# EAGLE schematic bitsClassicEdit (EAGLE 7.6.0)
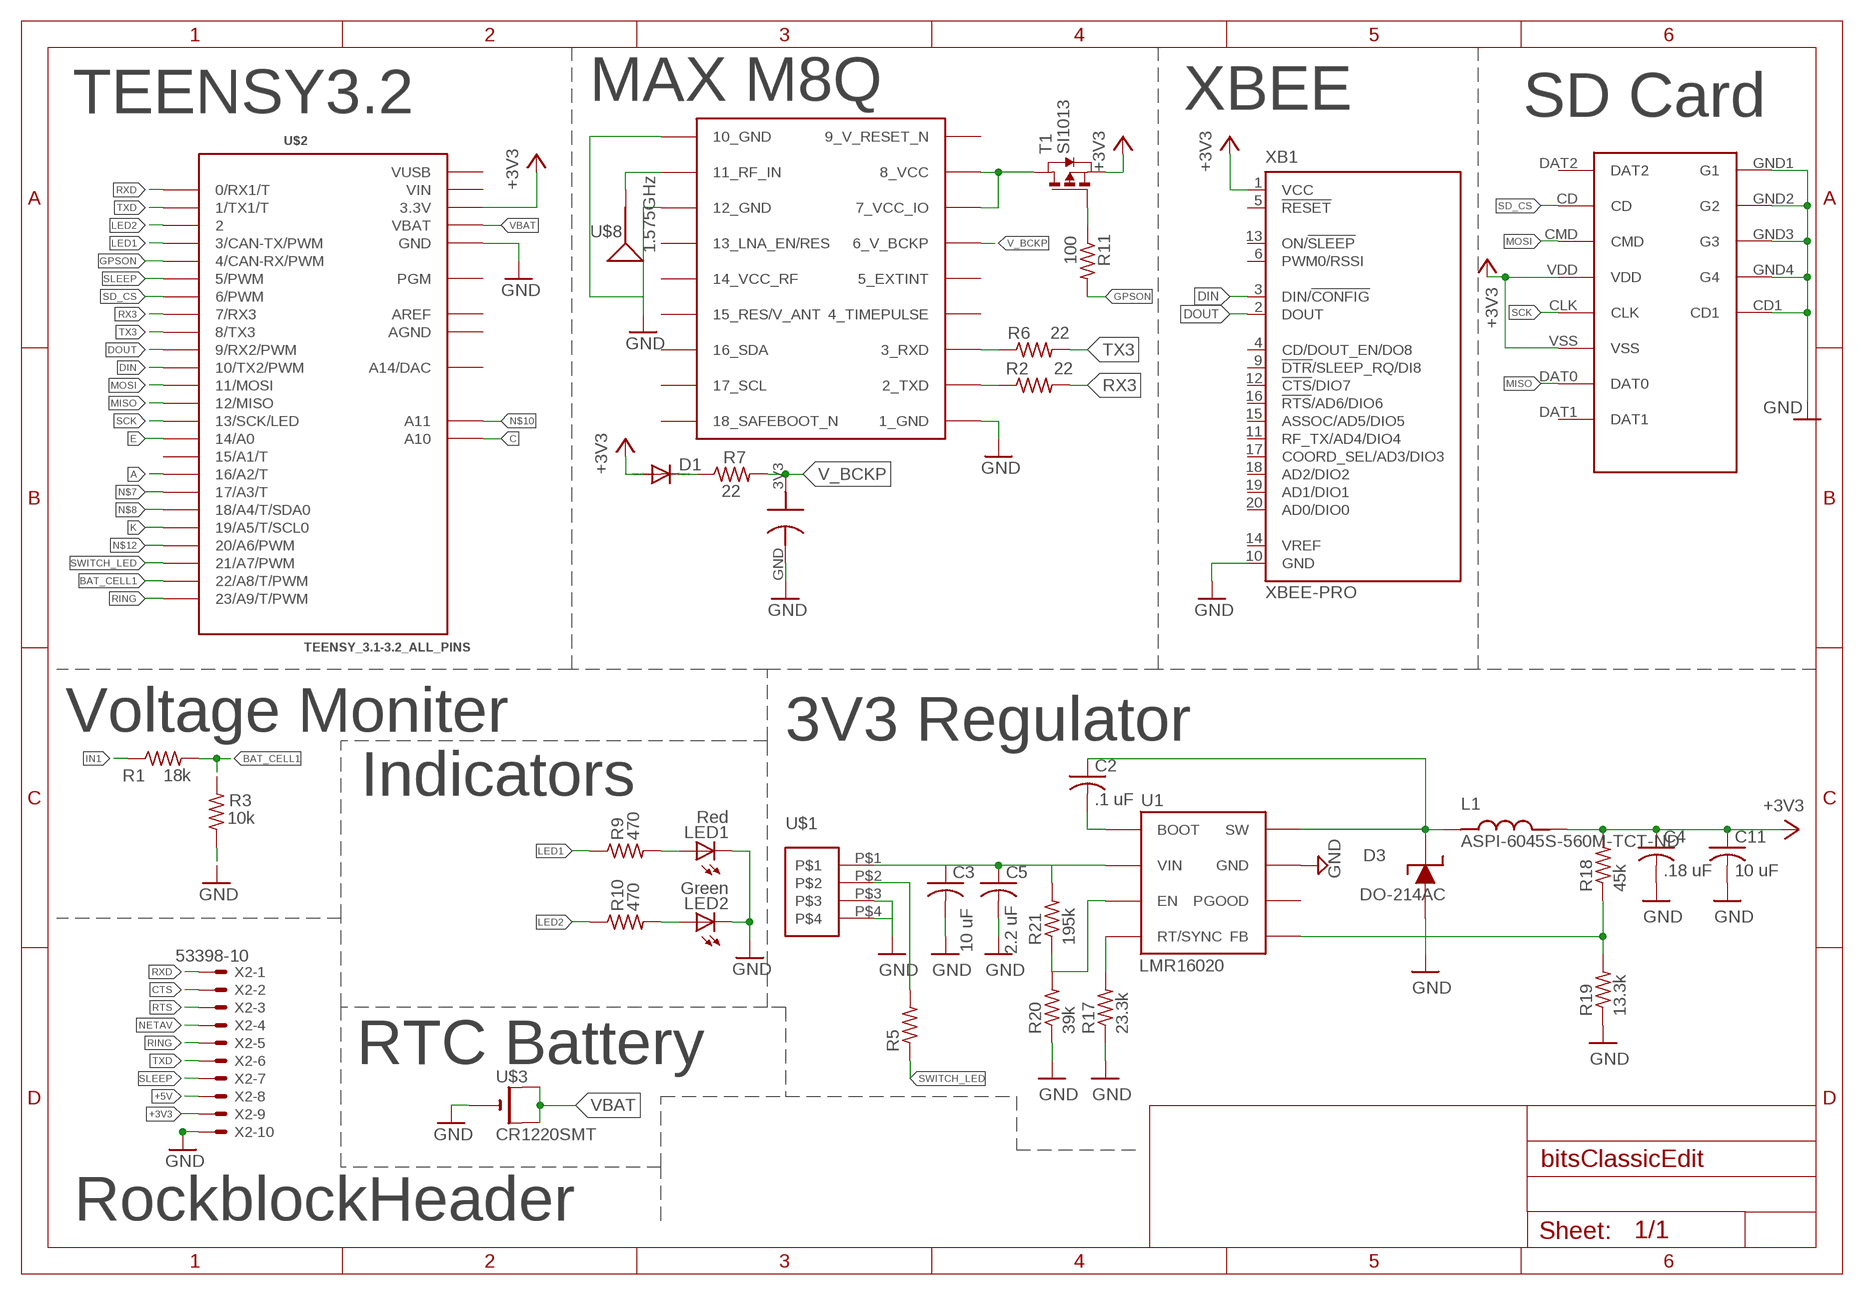
[diagram p0: schematic, sheet 1]

## Parts
C1  DCK-3R3E204T614-E  [ELNASUPERCAP]
C2  .1 uF  C-USC0603  [C0603]
C3  10 uF  C-USC1210  [C1210]
C4  .18 uF  C-USC0603  [C0603]
C5  2.2 uF  C-USC1210  [C1210]
C11  10 uF  C-USC0603  [C0603]
D1  DIODE-SOD523  [SOD523]
D3  DO-214AC  [DO-214AC]
L1  ASPI-6045S-560M-TCT-ND  [ABRACON]
LED1  Red  LEDCHIP-LED0603  [CHIP-LED0603]
LED2  Green  LEDCHIP-LED0603  [CHIP-LED0603]
R1  18k  R-US_R0603  [R0603]
R2  22  R-US_R0603  [R0603]
R3  10k  R-US_R0603  [R0603]
R5  R-US_R0603  [R0603]
R6  22  R-US_R0603  [R0603]
R7  22  R-US_R0603  [R0603]
R9  470  R-US_R0603  [R0603]
R10  470  R-US_R0603  [R0603]
R11  100  R-US_R0603  [R0603]
R17  23.3k  R-US_R0603  [R0603]
R18  45k  R-US_R0603  [R0603]
R19  13.3k  R-US_R0603  [R0603]
R20  39k  R-US_R0603  [R0603]
R21  195k  R-US_R0603  [R0603]
T1  SI1013  [SC-75]
U1  LMR16020  [SO8]
U$1  MICROCLASP_4  [4_PIN_MICROCLASP]
U$2  TEENSY_3.1-3.2_ALL_PINS  [TEENSY_3.0-3.2&LC_ALL_PINS]
U$3  CR1220SMT  [CR1220-SMD]
U$4  MICRO_SD  [MICRO_SD_HINGED]
U$7  MAX-M8  [MAX-M8]
U$8  1.575GHz  SPARKFUN-GPS_ANTENNAGPS-2X7MM  [SPARKFUN-GPS_ANT-GPS-2X7MM]
X2  53398-10  [53398-10]
XB1  XBEE-PRO  [XBEE-PRO]

## Nets
+3V3: C4.1 C11.1 D1.A L1.P$2 R18.2 T1.P$2(S) U$2.3.3V U$2.3.3V1(3.3V) U$4.VDD U$4.VSS X2.9 XB1.1(VCC)
+5V: X2.8
A: U$2.16/A2(16/A2/T)
BAT_CELL1: R1.2 R3.2 U$2.22/A8(22/A8/T/PWM)
C: U$2.A10
CTS: X2.2
DIN: U$2.10(10/TX2/PWM) XB1.3(DIN/!CONFIG)
DOUT: U$2.9(9/RX2/PWM) XB1.2(DOUT)
E: U$2.14/A0
FB: R18.1 R19.2 U1.P$5(FB)
GND: C1.GND C3.2 C4.2 C5.2 C11.2 D3.P$1 LED1.C LED2.C R3.1 R17.1 R19.1 R20.1 U1.P$7(GND) U1.PAD(GND) U$1.P$3 U$1.P$4 U$2.GND U$2.GND1(GND) U$3.- U$4.CD1 U$4.GND1(G1) U$4.GND2(G2) U$4.GND3(G3) U$4.GND4(G4) U$7.1_GND U$7.10_GND U$7.12_GND X2.10 XB1.10(GND)
GPSON: R11.2 U$2.4(4/CAN-RX/PWM)
IN1: C3.1 C5.1 R1.1 R21.2 U1.P$2(VIN) U$1.P$1
K: U$2.19/A5(19/A5/T/SCL0)
LED1: R9.1 U$2.3(3/CAN-TX/PWM)
LED2: R10.1 U$2.2
MISO: U$2.12(12/MISO) U$4.DAT0
MOSI: U$2.11(11/MOSI) U$4.CMD
N$1: U$7.11_RF_IN U$8.1(SIGNAL)
N$2: D1.C R7.1
N$3: R6.1 U$7.3_RXD
N$4: R2.1 U$7.2_TXD
N$5: LED2.A R10.2
N$6: LED1.A R9.2
N$7: U$2.17/A3(17/A3/T)
N$8: U$2.18/A4(18/A4/T/SDA0)
N$9: R11.1 T1.P$1(G)
N$10: U$2.A11
N$11: T1.P$3(D) U$7.7_VCC_IO U$7.8_VCC
N$12: U$2.20/A6(20/A6/PWM)
N$29: R17.2 U1.P$4(RT/SYNC)
N$31: C2.2 U1.P$1(BOOT)
N$33: R5.2 U$1.P$2
N$34: R20.2 R21.1 U1.P$3(EN)
NETAV: X2.4
RING: U$2.23/A9(23/A9/T/PWM) X2.5
RTS: X2.3
RX3: R2.2 U$2.7(7/RX3)
RXD: U$2.0(0/RX1/T) X2.1
SCK: U$2.13(13/SCK/LED) U$4.CLK
SD_CS: U$2.6(6/PWM) U$4.CD
SLEEP: U$2.5(5/PWM) X2.7
SW: C2.1 D3.P$2 L1.P$1 U1.P$8(SW)
SWITCH_LED: R5.1 U$2.21/A7(21/A7/PWM)
TX3: R6.2 U$2.8(8/TX3)
TXD: U$2.1(1/TX1/T) X2.6
V_BCKP: C1.3V3 R7.2 U$7.6_V_BCKP
VBAT: U$2.VBAT U$3.+$1(+) U$3.+$2(+1)
Unconnected: U1.P$6(PGOOD) U$2.15/A1(15/A1/T) U$2.PGM U$2.RESET/DAC(A14/DAC) U$4.DAT1 U$4.DAT2 U$7.4_TIMEPULSE U$7.5_EXTINT U$7.13_LNA_EN(13_LNA_EN/RES) U$7.14_VCC_RF U$7.15_V_ANT/RESERVED(15_RES/V_ANT) U$7.16_SDA U$7.17_SCL U$7.18_SAFEBOOT_N XB1.4(CD/DOUT_EN/DO8) XB1.5(!RESET) XB1.6(PWM0/RSSI) XB1.9(!DTR!/SLEEP_RQ/DI8) XB1.11(RF_TX/AD4/DIO4) XB1.12(!CTS!/DIO7) XB1.13(ON/!SLEEP) XB1.14(VREF) XB1.15(ASSOC/AD5/DIO5) XB1.16(!RTS!/AD6/DIO6) XB1.17(COORD_SEL/AD3/DIO3) XB1.18(AD2/DIO2) XB1.19(AD1/DIO1) XB1.20(AD0/DIO0)

## Notes on the sheet
- TEENSY3.2 | MAX M8Q | XBEE | SD Card
- Voltage Moniter | 3V3 Regulator
- Indicators
- RTC Battery
- RockblockHeader

## Power pins joined to a net without a drawn wire
9_V_RESET_N: U$7.9_RESET_N(9_V_RESET_N)
AGND: U$2.AGND
AREF: U$2.AREF
VIN: U$2.VIN
VUSB: U$2.VUSB

## Library data of the parts
C1 = jmolterLib:DCK-3R3E204T614-E: ELNA Supercapacitor 3.3V max DCK-3R3E204T614-E 0.2F DCK-3R3E404T614-E 0.4F
C2-C5 C11 = resistor:C-US: CAPACITOR, American symbol
D1 = diode:DIODE-: DIODE
D3 = HASP:DO-214AC
L1 = inductors:ASPI-6045S-560M-TCT-ND
LED1 LED2 = led:LED: LED OSRAM: - CHIPLED LG R971, LG N971, LY N971, LG Q971, LY Q971, LO R971, LY R971 LH N974, LH R974 LS Q976, LO Q976, LY Q976 LO Q996 - Hyper CHIPLED LW Q18S LB Q993, LB Q99A, LB R99A - SideLED LS A670, LO A670, LY A670, LG A670, LP A670 LB A673, LV A673, LT A673, LW A673 LH A674 LY A675 LS A676, LA A676, LO A676, LY A676, LW A676 LS A679, LY A679, LG A679 - Hyper Micro SIDELED® LS Y876, LA Y876, LO Y876, LY Y876 LT Y87S - SmartLED LW L88C, LW L88S LB L89C, LB L89S, LG L890 LS L89K, LO L89K, LY L89K LS L896, LA L896, LO L896, LY L896 - TOPLED LS T670, LO T670, LY T670, LG T670, LP T670 LSG T670, LSP T670, LSY T670, LOP T670, LYG T670 LG T671, LOG T671, LSG T671 LB T673, LV T673, LT T673, LW T673 LH T674 LS T676, LA T676, LO T676, LY T676, LB T676, LH T676, LSB T676, LW T676 LB T67C, LV T67C, LT T67C, LS T67K, LO T67K, LY T67K, LW E67C LS E67B, LA E67B, LO E67B, LY E67B, LB E67C, LV E67C, LT E67C LW T67C LS T679, LY T679, LG T679 LS T770, LO T770, LY T770, LG T770, LP T770 LB T773, LV T773, LT T773, LW T773 LH T774 LS E675, LA E675, LY E675, LS T675 LS T776, LA T776, LO T776, LY T776, LB T776 LHGB T686 LT T68C, LB T68C - Hyper Mini TOPLED® LB M676 - Mini TOPLED Santana® LG M470 LS M47K, LO M47K, LY M47K Source: http://www.osram.convergy.de LUXEON: - LUMILED® LXK2-PW12-R00, LXK2-PW12-S00, LXK2-PW14-U00, LXK2-PW14-V00 LXK2-PM12-R00, LXK2-PM12-S00, LXK2-PM14-U00 LXK2-PE12-Q00, LXK2-PE12-R00, LXK2-PE12-S00, LXK2-PE14-T00, LXK2-PE14-U00 LXK2-PB12-K00, LXK2-PB12-L00, LXK2-PB12-M00, LXK2-PB14-N00, LXK2-PB14-P00, LXK2-PB14-Q00 LXK2-PR12-L00, LXK2-PR12-M00, LXK2-PR14-Q00, LXK2-PR14-R00 LXK2-PD12-Q00, LXK2-PD12-R00, LXK2-PD12-S00 LXK2-PH12-R00, LXK2-PH12-S00 LXK2-PL12-P00, LXK2-PL12-Q00, LXK2-PL12-R00 Source: www.luxeon.com KINGBRIGHT: KA-3528ASYC Source: www.kingbright.com
R1 R3 R5 R9 R10 R17-R21 = resistor:R-US_: RESISTOR, American symbol
R2 R6 R7 R11 = rcl:R-US_: RESISTOR, American symbol; SPICEPREFIX: R
T1 = cmdLibs:SI1013: A PMOS that can be found in LTSPICE
U1 = HASP:LMR16020
U$1 = NR_connectors:MICROCLASP_4
U$2 = Teensy_3_and_LC_Series_Boards_v1.4:TEENSY_3.1-3.2_ALL_PINS: Footprint for Teensy 3.1 or 3.2 board using all through-holes, i.e. the entire perimeter plus the 4 through-holes inboard (A10,A11,AREF, VUSB)
U$3 = adafruit:CR1220: CR1216/CR1220/CR1225 12mm 3V lithium coin cell Great for battery packup. Both SMT and THM holders. Note the THM package has the ground pads on both sides of the PCB so that the masks are the same - this reduces the cost
U$4 = NR_connectors:MICRO_SD
U$7 = ubloxLib:MAX-M8: u-blox MAX GNSS module
U$8 = Tracksoar v2 :SPARKFUN-GPS_ANTENNA: Single-ended Antennae 1.575GHz antennae with just one terminal. These are all chip antennae. 1575MHz (GPS) Antennae ANT-GPS-2X7MM - 2.0 x 7.0 mm chip antenna. (SparkFun Product <https://www.sparkfun.com/products/9131>) ANT-GPS-2X8MM - 2.0 x 8.0 mm chip antenna. (SparkFun Product <https://www.sparkfun.com/products/8418>); PROD_ID: ANT-09087; SF_ID: GPS-09131
X2 = con-molex:53?-10: CONNECTOR wire to board 1.25 mm (.049 inch) pitch header; MF: MOLEX; MPN: 53398-1071; OC_FARNELL: unknown; OC_NEWARK: 59J0425
XB1 = maxstream:XBEE: XBee (TM) /XBee-PRO(TM) OEM RF Modules Source: MaxStream, Inc. xbee_productmanual.pdf; MPN: XBP24-AWI-001; OC_FARNELL: 1337916; OC_NEWARK: 42M2667